# Altium schematic sheet FSR.SchDoc
size A
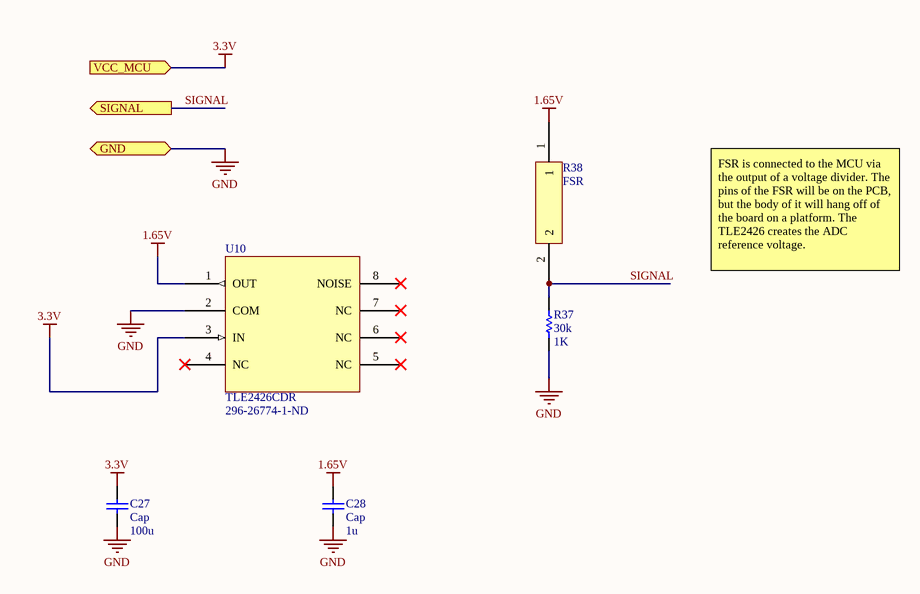
[diagram p0: FSR.SchDoc]

## Parts
C27  Cap  value 100u  [C0805]
C28  Cap  value 1u  [C0805]
R37  30k  value 1K  [6-0805_L]
R38  FSR  [HDR1X2H]
U10  TLE2426CDR  Supplier Part Number 1: 296-26774-1-ND  [TLE2426CDR]

## Ports
GND (bidir), SIGNAL (out), VCC_MCU (in)

## Nets
1.65V: C28.2 R38.1 U10.1(OUT)
3.3V: C27.2 U10.3(IN) ; port VCC_MCU
GND: C27.1 C28.1 R37.2 U10.2(COM) ; port GND
SIGNAL: R37.1 R38.2 ; port SIGNAL

Not connected (* = marked no-connect by the designer): U10 4(NC)* 5(NC)* 6(NC)* 7(NC)* 8(NOISE)*

## Notes on the sheet
- FSR is connected to the MCU via the output of a voltage divider. The pins of the FSR will be on the PCB, but the body of it will hang off of the board on a platform. The TLE2426 creates the ADC reference voltage.

## Library data of the parts
C27 C28 = Cap: Capacitor; Published: 8-Jun-2000; LatestRevisionDate: 17-Jul-2002; LatestRevisionNote: Re-released for DXP Platform.; PackageReference: RAD-0.3; Publisher: Altium Limited; PackageDescription: Radial Cap, Thru-Hole; 2 Leads; 0.3 in Pin Spacing
R37 = Res1: Resistor; Published: 8-Jun-2000; LatestRevisionDate: 17-Jul-2002; LatestRevisionNote: Re-released for DXP Platform.; PackageReference: AXIAL-0.3; Publisher: Altium Limited; PackageDescription: Axial Device, Thru-Hole; 2 Leads; 0.3 in Pin Spacing
R38 = FSR-1075-406: Force Sensing Resistor
U10 = TLE2426: Rail Splitter IC; Manufacturer: Texas Instruments; Max Input Voltage: 40V; Output Voltage: 20V; Max Output Current: 20mA; Min Output Voltage: 2V; Temperature Coefficient: 35ppm/°C; Reference Type: Adjustable,Ground Reference (Virtual); Tolerance: 1%; Operating Supply Current: 400uA; Output Type: Adjustable; Supplier 1: Digi-Key; Manufacturer Part Number: TLE2426CDR; RoHS: Yes; Stock 1: 17506; Pricing 1: 1 = 2.14000, 10 = 1.91900, 100 = 1.54230, 500 = 1.26716, 1000 = 1.04993 (USD); Mount: Surface Mount; Case/Package: SOIC; Number of Pins: 8; Weight: 0.002677oz; Min Operating Temperature: -55°C; Max Operating Temperature: 125°C; Packaging: Tape and Reel; Package Quantity: 1; Max Output Voltage: 20V; Output Current: 20mA; Reference Voltage: 20V; Length: 4.9mm; Height: 1.58mm; Width: 3.91mm; Radiation Hardening: No; Lead Free: Lead Free; REACH SVHC: No SVHC; ComponentLink1URL: http://www.ti.com/lit/ds/symlink/tle2426.pdf?src-supplier=Digi-Key; ComponentLink1Description: http://www.ti.com/lit/ds/symlink/tle2426.pdf?src-supplier=Digi-Key; ComponentLink2URL: http://www.ti.com/general/docs/lit/getliterature.tsp?genericPartNumber=TLE2426&&fileType=pdf&src-supplier=Element14; ComponentLink2Description: http://www.ti.com/general/docs/lit/getliterature.tsp?genericPartNumber=TLE2426&&fileType=pdf&src-supplier=Element14; ComponentLink3URL: http://www.ti.com/lit/ds/slos098d/slos098d.pdf?src-supplier=Avnet+Europe; ComponentLink3Description: http://www.ti.com/lit/ds/slos098d/slos098d.pdf?src-supplier=Avnet+Europe; ComponentLink4URL: http://www.farnell.com/datasheets/1362010.pdf?src-supplier=Farnell; ComponentLink4Description: http://www.farnell.com/datasheets/1362010.pdf?src-supplier=Farnell; ComponentLink5URL: http://www.ti.com/general/docs/lit/getliterature.tsp?genericPartNumber=TLE2426&&fileType=pdf&src-supplier=Avnet; ComponentLink5Description: http://www.ti.com/general/docs/lit/getliterature.tsp?genericPartNumber=TLE2426&&fileType=pdf&src-supplier=Avnet